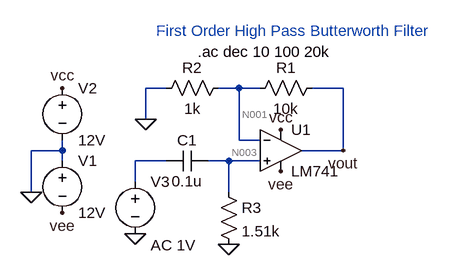
[diagram p0: schematic first_order_high_pass.asc]
first_order_high_pass.asc, the LTspice schematic file:
Version 4.1
SHEET 1 880 680
WIRE 112 96 80 96
WIRE 224 96 192 96
WIRE 256 96 224 96
WIRE 384 96 336 96
WIRE 80 144 80 96
WIRE 224 176 224 96
WIRE 256 176 224 176
WIRE -48 192 -48 176
WIRE -48 192 -96 192
WIRE 384 192 384 96
WIRE 384 192 320 192
WIRE -48 208 -48 192
WIRE 112 208 64 208
WIRE 208 208 176 208
WIRE 256 208 208 208
WIRE 64 240 64 208
WIRE -96 256 -96 192
WIRE 208 256 208 208
FLAG -96 256 0
FLAG 288 160 vcc
FLAG -48 96 vcc
FLAG 288 224 vee
FLAG -48 288 vee
FLAG 80 144 0
FLAG 384 192 vout
FLAG 64 320 0
FLAG 208 336 0
SYMBOL voltage -48 192 R0
WINDOW 123 0 0 Left 0
WINDOW 39 0 0 Left 0
SYMATTR InstName V1
SYMATTR Value 12V
SYMBOL voltage -48 80 R0
WINDOW 123 0 0 Left 0
WINDOW 39 0 0 Left 0
SYMATTR InstName V2
SYMATTR Value 12V
SYMBOL LM741 288 128 R0
SYMATTR InstName U1
SYMBOL res 352 80 R90
WINDOW 0 0 56 VBottom 2
WINDOW 3 32 56 VTop 2
SYMATTR InstName R1
SYMATTR Value 10k
SYMBOL res 208 80 R90
WINDOW 0 0 56 VBottom 2
WINDOW 3 32 56 VTop 2
SYMATTR InstName R2
SYMATTR Value 1k
SYMBOL res 192 240 R0
SYMATTR InstName R3
SYMATTR Value 1.51k
SYMBOL cap 176 192 R90
WINDOW 0 0 32 VBottom 2
WINDOW 3 32 32 VTop 2
SYMATTR InstName C1
SYMATTR Value 0.1u
SYMBOL voltage 64 224 R0
WINDOW 123 24 114 Left 2
WINDOW 39 0 0 Left 0
SYMATTR Value2 AC 1V
SYMATTR InstName V3
SYMATTR Value ""
TEXT 96 8 Left 2 ;First Order High Pass Butterworth Filter
TEXT 160 40 Left 2 !.ac dec 10 100 20k

The netlist it stands for:
* first_order_high_pass.asc
V1 0 vee 12V
V2 vcc 0 12V
X§U1 N003 N001 vcc vee vout LM741  ; pins In+ In- V+ V- OUT
R1 vout N001 10k
R2 N001 0 1k
R3 N003 0 1.51k
C1 N003 N002 0.1u
V3 N002 0 AC 1V
* First Order High Pass Butterworth Filter
.ac dec 10 100 20k
.lib LM741.lib
.backanno
.end

* Results of the author's LTspice run, read from the files saved beside the schematic
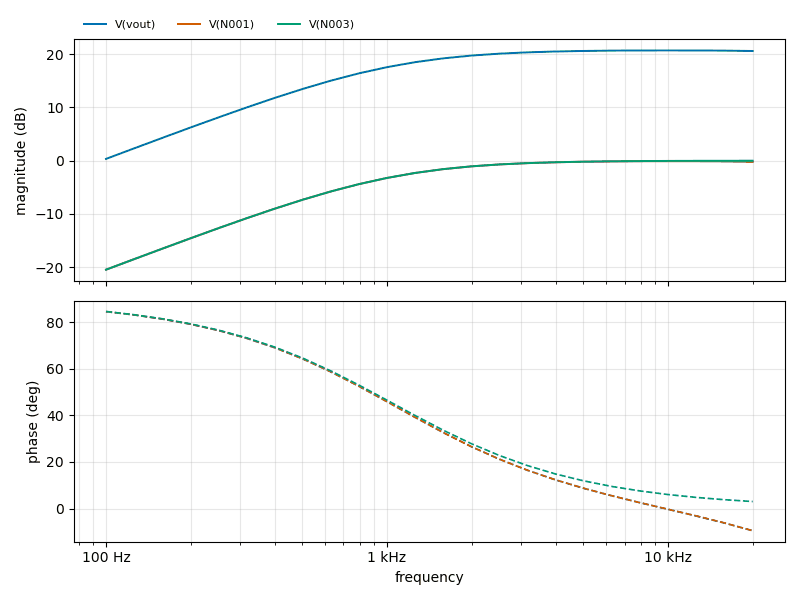
[diagram p1: AC Analysis of first_order_high_pass.asc, plotted from the saved traces]
* AC Analysis, 1 run:
*   V(vout): 0.33 dB at 100 Hz, 20.62 dB at 20 kHz, peak 20.73 dB at 10 kHz, 3 dB below the peak at 1.034 kHz
*   V(N001): -20.50 dB at 100 Hz, -0.21 dB at 20 kHz, peak -0.10 dB at 10 kHz, 3 dB below the peak at 1.034 kHz
*   V(N003): -20.50 dB at 100 Hz, -0.01 dB at 20 kHz, peak -0.01 dB at 20 kHz, 3 dB below the peak at 1.056 kHz